# EAGLE design watch_tubes_final (EAGLE 6.6.0)
MY_DRAWING_NAME: Numitron Geekwatch Tubes Board
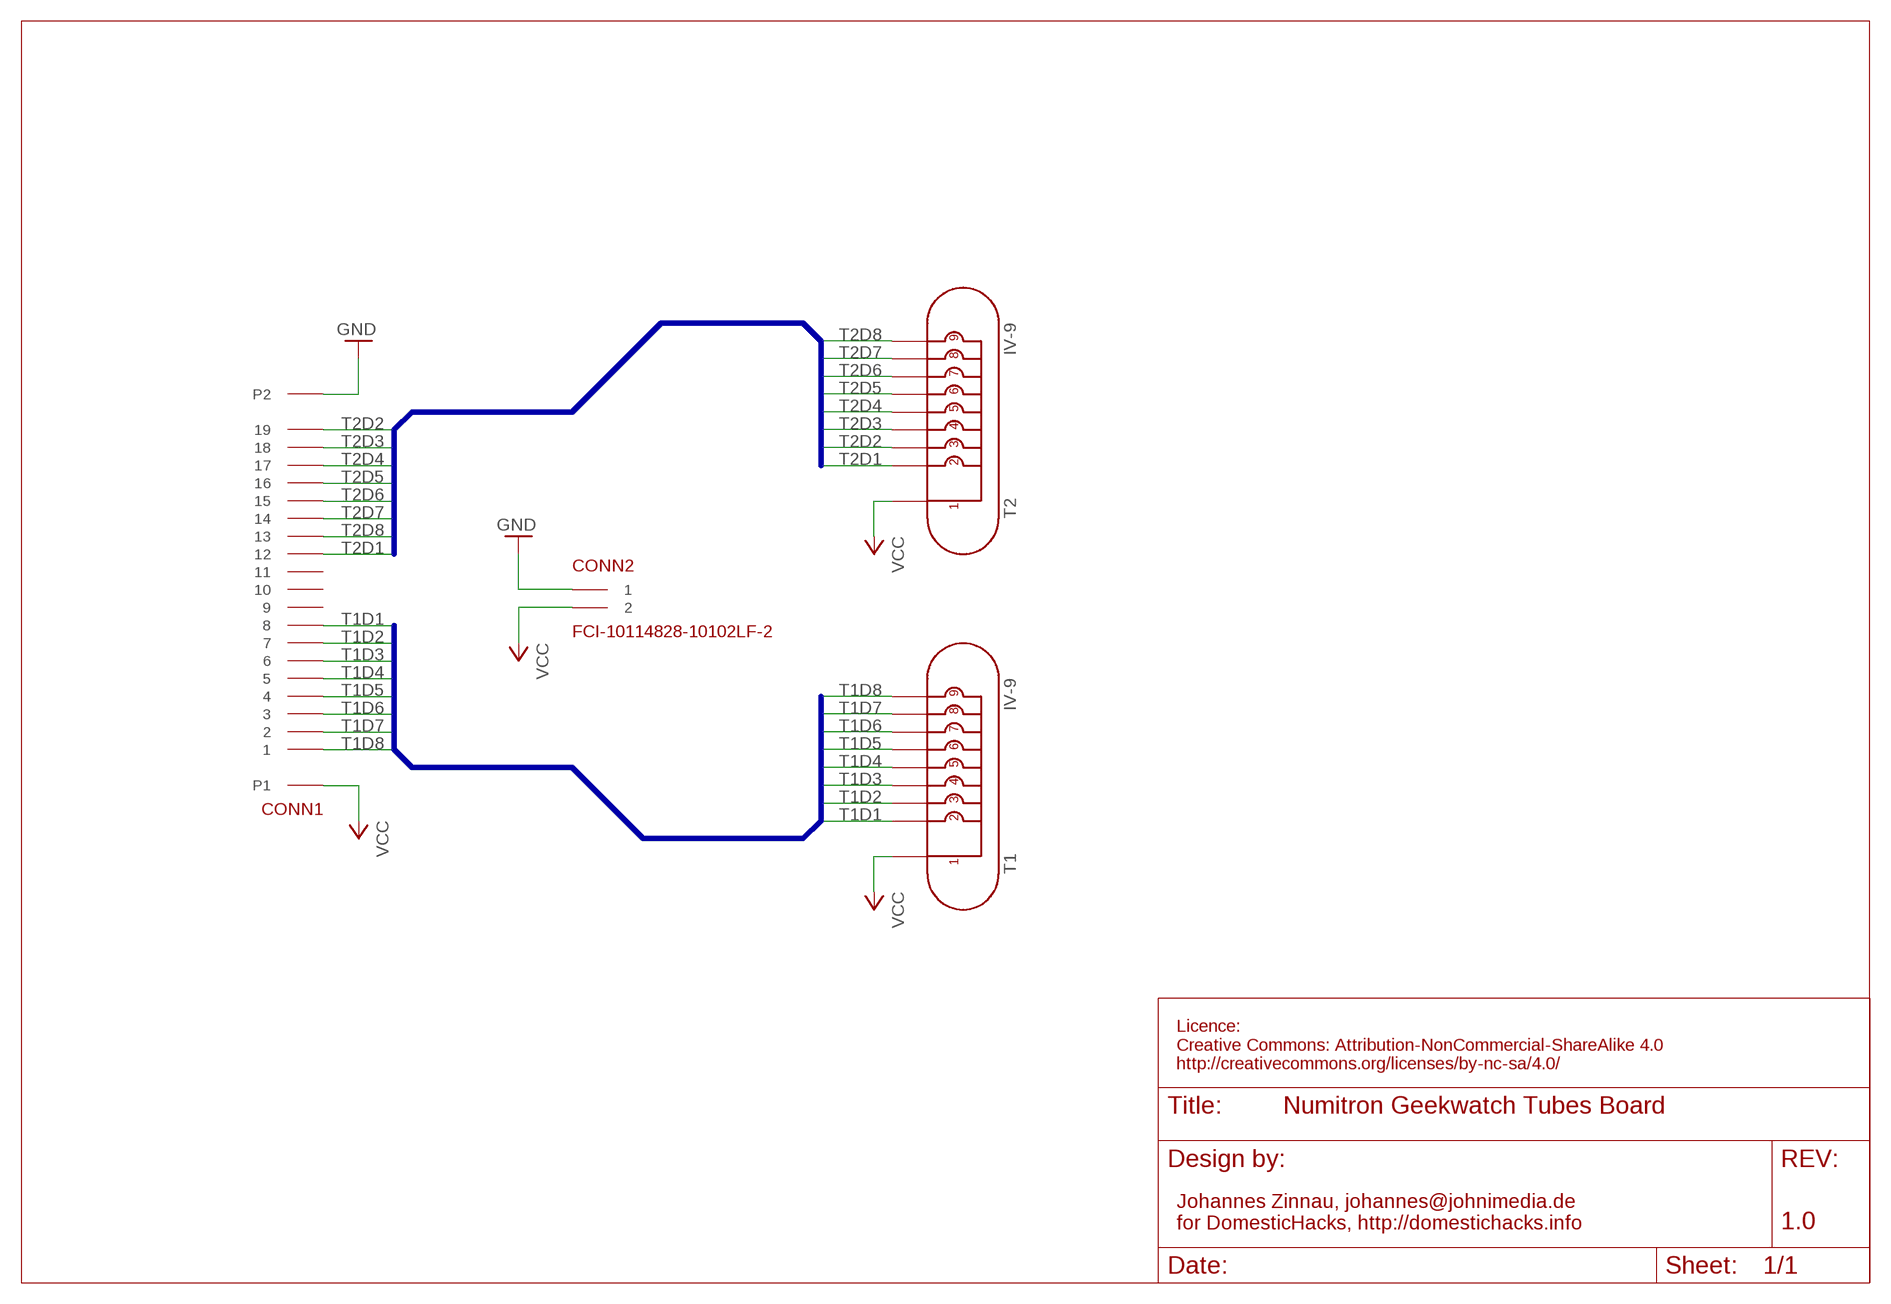
[diagram p0: schematic, sheet 1]

## Parts
CONN1  PCBMOUNT-20SECOND  [PCBMOUNT-VERTICAL-20-2]
CONN2  FCI-10114828-10102LF-2  [FCI-10114828-10102LF-2]
T1  IV-9  [IV-9]
T2  IV-9  [IV-9]

## Nets
GND: CONN1.P2 CONN2.1
T1D1: CONN1.8 T1.2
T1D2: CONN1.7 T1.3
T1D3: CONN1.6 T1.4
T1D4: CONN1.5 T1.5
T1D5: CONN1.4 T1.6
T1D6: CONN1.3 T1.7
T1D7: CONN1.2 T1.8
T1D8: CONN1.1 T1.9
T2D1: CONN1.12 T2.2
T2D2: CONN1.19 T2.3
T2D3: CONN1.18 T2.4
T2D4: CONN1.17 T2.5
T2D5: CONN1.16 T2.6
T2D6: CONN1.15 T2.7
T2D7: CONN1.14 T2.8
T2D8: CONN1.13 T2.9
VCC: CONN1.P1 CONN2.2 T1.1 T2.1
Unconnected: CONN1.9 CONN1.10 CONN1.11

## Buses
T1D[1..8]
T2D[1..8]

## Notes on the sheet
- Licence: 
  Creative Commons: Attribution-NonCommercial-ShareAlike 4.0
  http://creativecommons.org/licenses/by-nc-sa/4.0/
- Johannes Zinnau, johannes@johnimedia.de 
  for DomesticHacks, http://domestichacks.info
- 1.0

## Library data of the parts
CONN1 = domestichacks:PCBMOUNT-20
CONN2 = domestichacks:FCI-10114828-10102LF-2: STIFTLEISTE, 1.25MM, SMT, 2POL
T1 T2 = domestichacks:IV-9

## Board
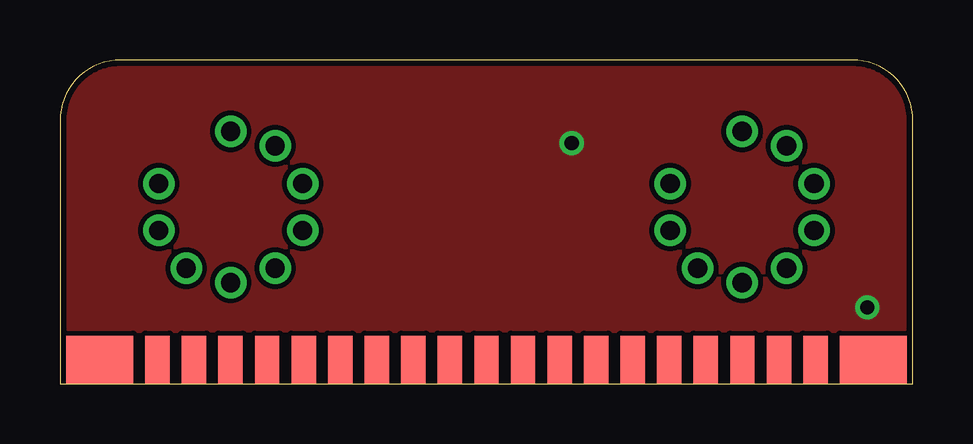
[diagram p1: board, top side]
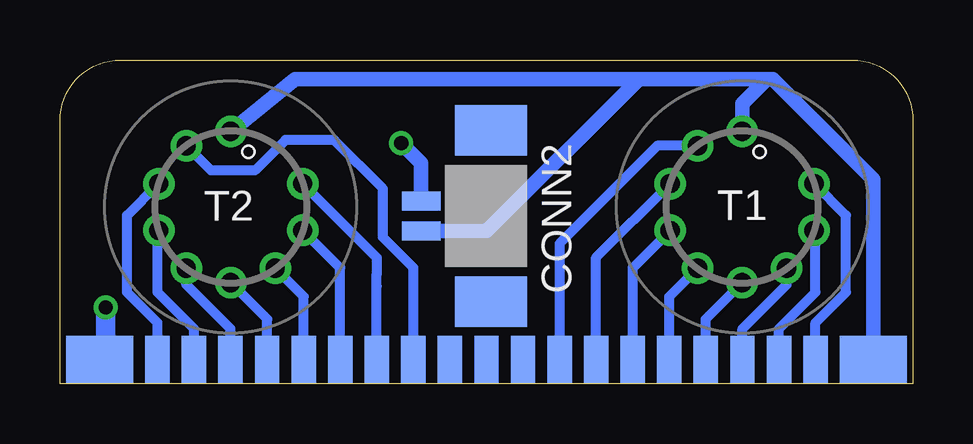
[diagram p2: board, bottom side, seen from below]

Size 35.56 x 13.5 mm. Coordinates in mm from the lower left corner, seen from the top.
Outline: 0,0 35.56,0 35.56,10.96 arc90 33.02,13.5 2.54,13.5 arc90 0,10.96 0,0
Copper layers (1*16): Top 0.035mm / dielectric 1.5mm / Bottom 0.035mm
Design rules "proto_tight": minimum track width 6mil, minimum drill 12mil, track to track 8mil, track to pad 8mil, pad to pad 8mil, via to via 8mil, smd to smd 6mil, copper to edge 10mil, drill to drill 8mil, minimum pad ring 10mil, minimum via ring 8mil, stop-mask expansion 4mil, vias tented up to drill 25mil, thermal gap 10mil

### Footprints (pad centres in the part's own frame; a part is rotated, then mirrored left to right if it is on the bottom)
PCBMOUNT-VERTICAL-20-2 = smd 1.016 x 2: 1 31.496,1; 2 29.972,1; 3 28.448,1; 4 26.924,1; 5 25.4,1; 6 23.876,1; 7 22.352,1; 8 20.828,1; 9 19.304,1; 10 17.78,1; 11 16.256,1; 12 14.732,1; 13 13.208,1; 14 11.684,1; 15 10.16,1; 16 8.636,1; 17 7.112,1; 18 5.588,1; 19 4.064,1 | smd 1.016 x 2 bottom: 20 4.064,1; 21 5.588,1; 22 7.112,1; 23 8.636,1; 24 10.16,1; 25 11.684,1; 26 13.208,1; 27 14.732,1; 28 16.256,1; 29 17.78,1; 30 19.304,1; 31 20.828,1; 32 22.352,1; 33 23.876,1; 34 25.4,1; 35 26.924,1; 36 28.448,1; 37 29.972,1; 38 31.496,1 | smd 2.794 x 2: P1 33.909,1; P2 1.651,1 | smd 2.794 x 2 bottom: P3 1.649,1; P4 33.909,1
FCI-10114828-10102LF-2 = smd 0.8 x 1.6: 1 0.625,3.1; 2 -0.625,3.1 | smd 2.1 x 3: MNT1 3.575,0.2; MNT2 -3.575,0.2
IV-9 = drill 0.8: 1 1.854,-2.552; 2 3,-0.975; 3 3,0.975; 4 1.854,2.552; 5 0,3.154; 6 -1.854,2.552; 7 -3,0.975; 8 -3,-0.975; 9 -1.854,-2.552

### Placement (x,y rotation side)
CONN1  35.56,0 0 bottom
CONN2  17.4,6.99 90 bottom
T1  7.12,7.37 144 bottom
T2  28.44,7.37 144 bottom

### Tracks (layer width: path | path; a pad name or v marks a point on that pad's centre or on a via)
GND  (via drill 0.6)
  Bottom 0.61: CONN2.1 20.5,9.2 v21.34,10.03
  Bottom 0.813: v33.66,3.17 33.66,1.25 CONN1.P2
  pour Top: 0,13.34 35.56,13.34 35.56,0 0,0
T1D1
  Bottom 0.406: T1.2 10.66,9.92 14.73,5.84 CONN1.8
T1D2
  Bottom 0.406: CONN1.7 13.21,5.25 T1.3
T1D3
  Bottom 0.406: CONN1.6 11.68,4.83 T1.4
T1D4
  Bottom 0.406: CONN1.5 10.16,3.63 T1.5
T1D5
  Bottom 0.406: CONN1.4 8.64,2.7 T1.6
T1D6
  Bottom 0.406: CONN1.3 7.11,2.29 5.27,4.13 T1.7
T1D7
  Bottom 0.406: CONN1.2 5.59,2.29 4.06,3.81 4.06,5.83 T1.8
T1D8
  Bottom 0.406: CONN1.1 4.06,2.54 2.79,3.81 2.79,7.01 T1.9
T2D1
  Bottom 0.406: CONN1.12 20.83,4.83 22.1,6.1 22.1,8.13 24.13,10.16 26.16,10.16 27.43,8.89 29.27,8.89 T2.2
T2D2
  Bottom 0.406: CONN1.19 31.5,2.54 32.77,3.81 32.77,7.01 T2.3
T2D3
  Bottom 0.406: CONN1.18 29.97,2.29 31.5,3.81 31.5,6.33 T2.4
T2D4
  Bottom 0.406: CONN1.17 28.45,2.29 30.29,4.13 T2.5
T2D5
  Bottom 0.406: CONN1.16 26.92,2.7 T2.6
T2D6
  Bottom 0.406: CONN1.15 25.4,3.63 T2.7
T2D7
  Bottom 0.406: CONN1.14 23.88,4.83 T2.8
T2D8
  Bottom 0.406: CONN1.13 22.35,4.06 22.35,4.57 22.35,5.25 T2.9
VCC
  Bottom 0.61: 6.1,12.7 11.43,12.7 | 11.43,12.7 25.75,12.7 T2.1 | CONN1.P1 1.65,8.51 5.84,12.7 6.1,12.7 | T1.1 7.12,11.68 6.1,12.7 | CONN2.2 17.77,6.36 11.43,12.7